# EAGLE board qo-100-upconverter (EAGLE 9.6.2), part 1 of 2
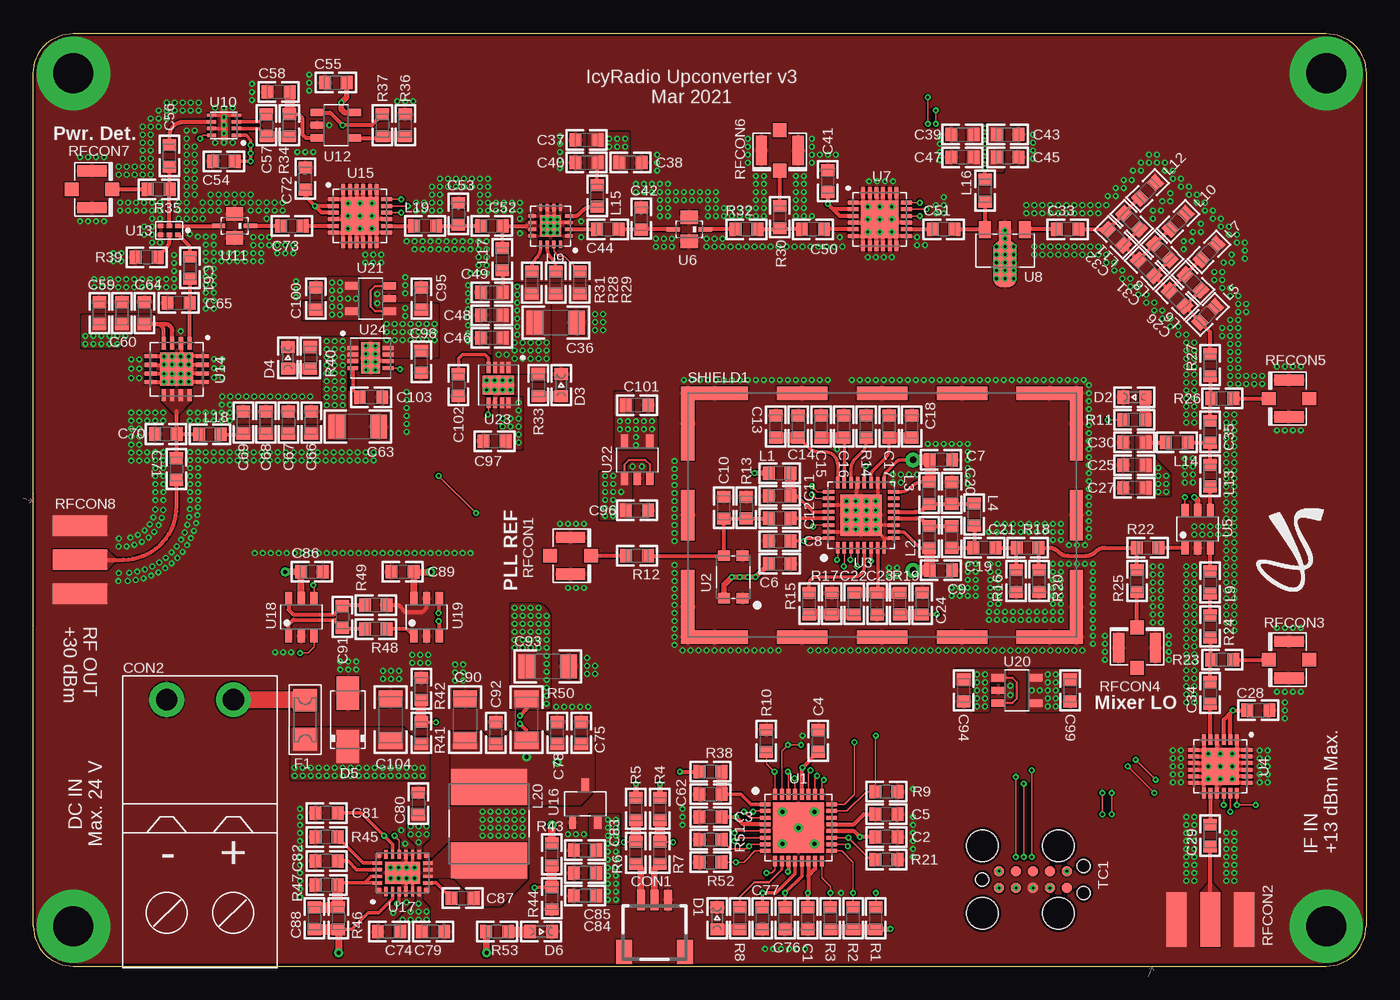
[diagram p13: board, top side]
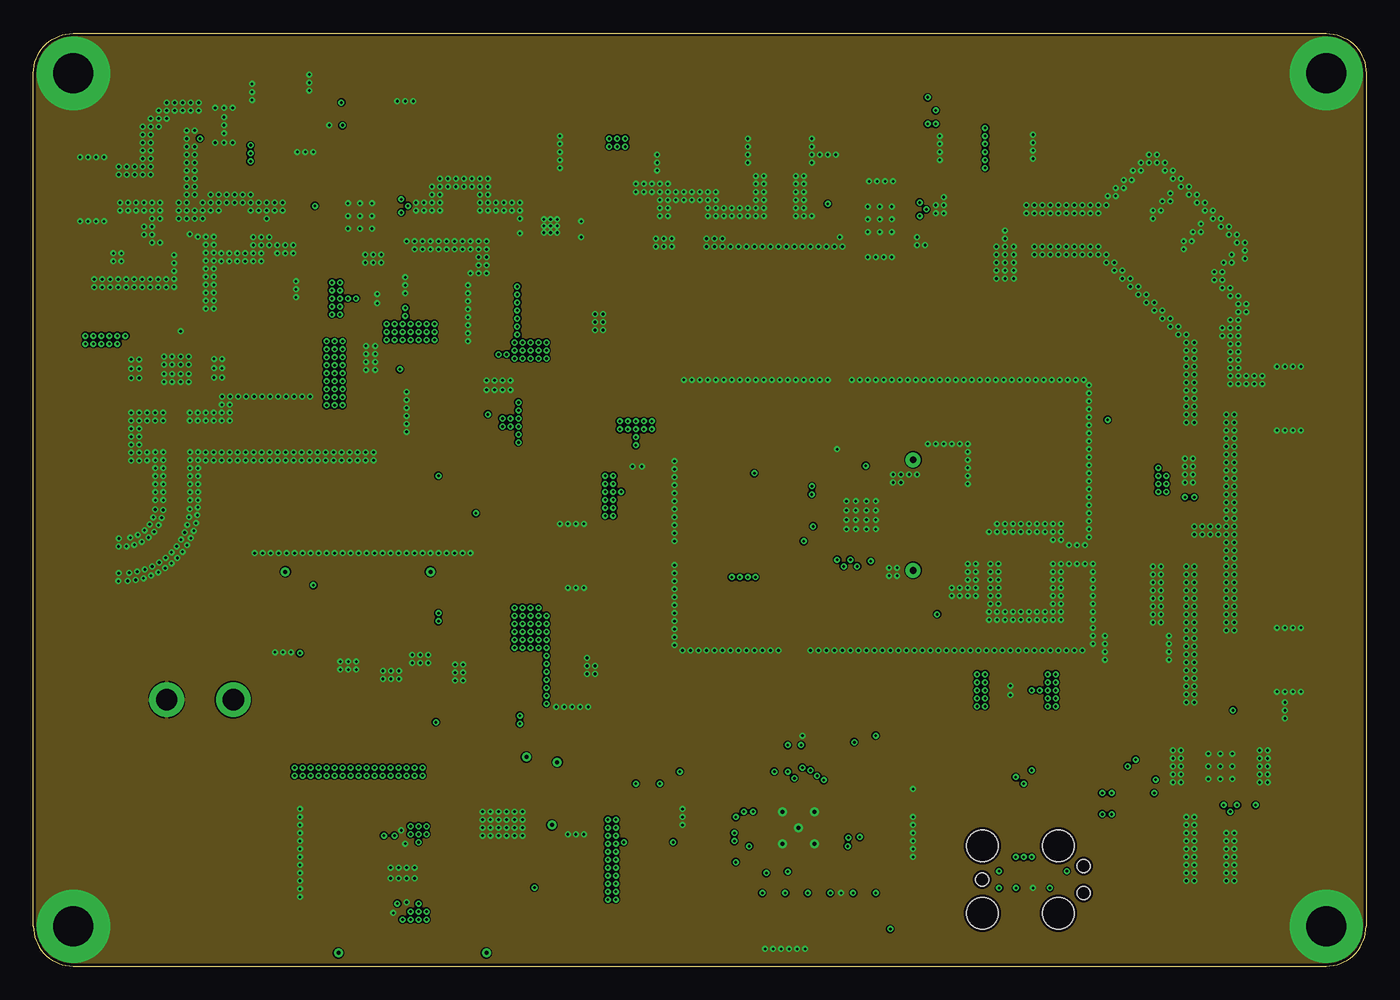
[diagram p14: board, inner layer Route2]
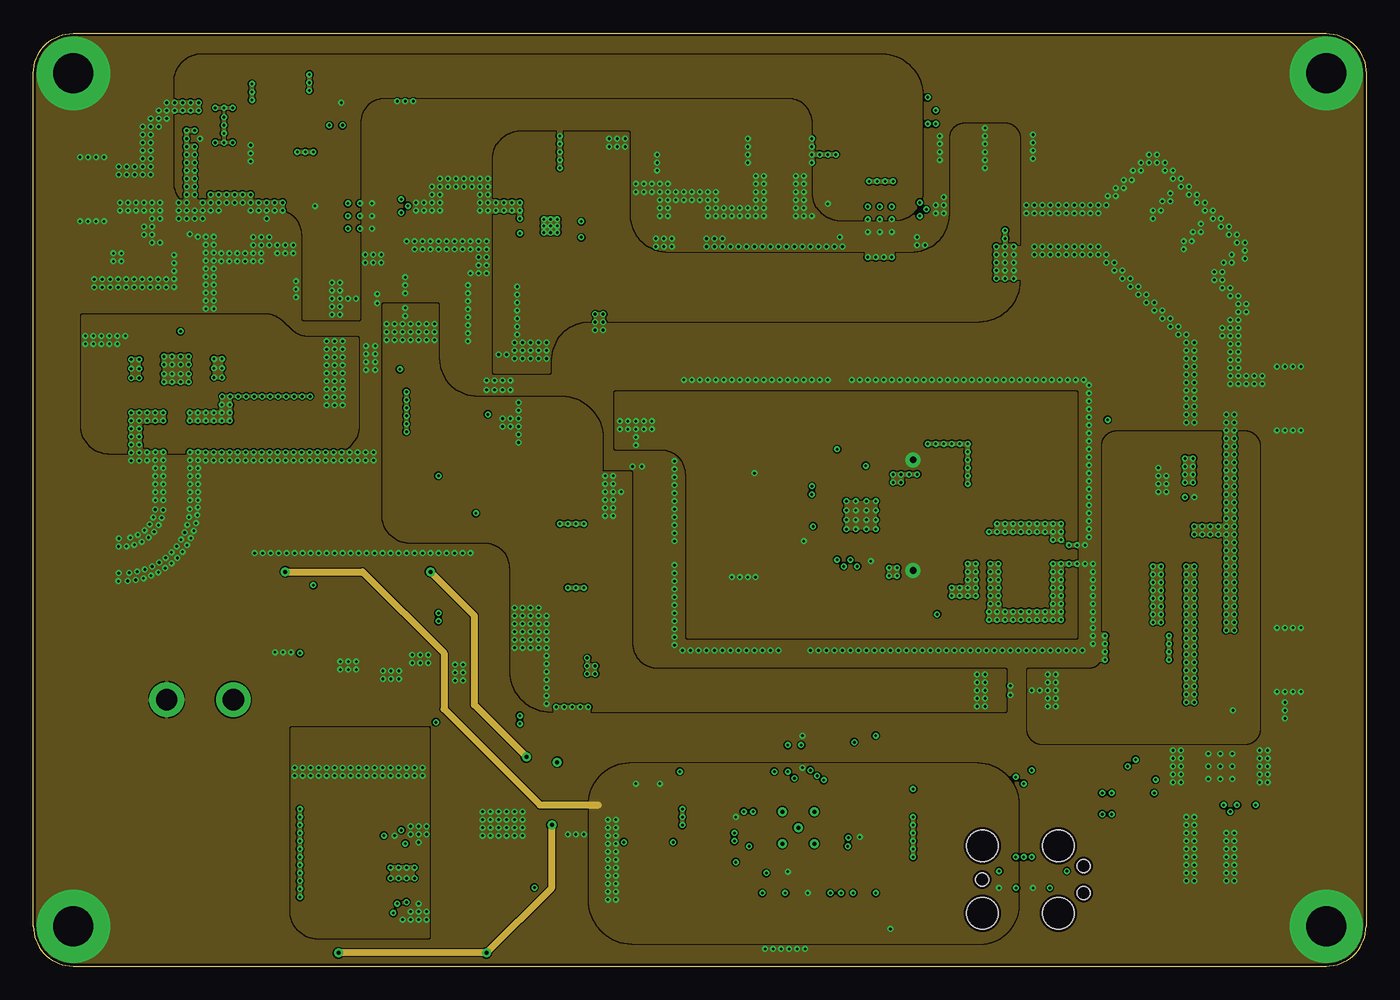
[diagram p15: board, inner layer Route15]
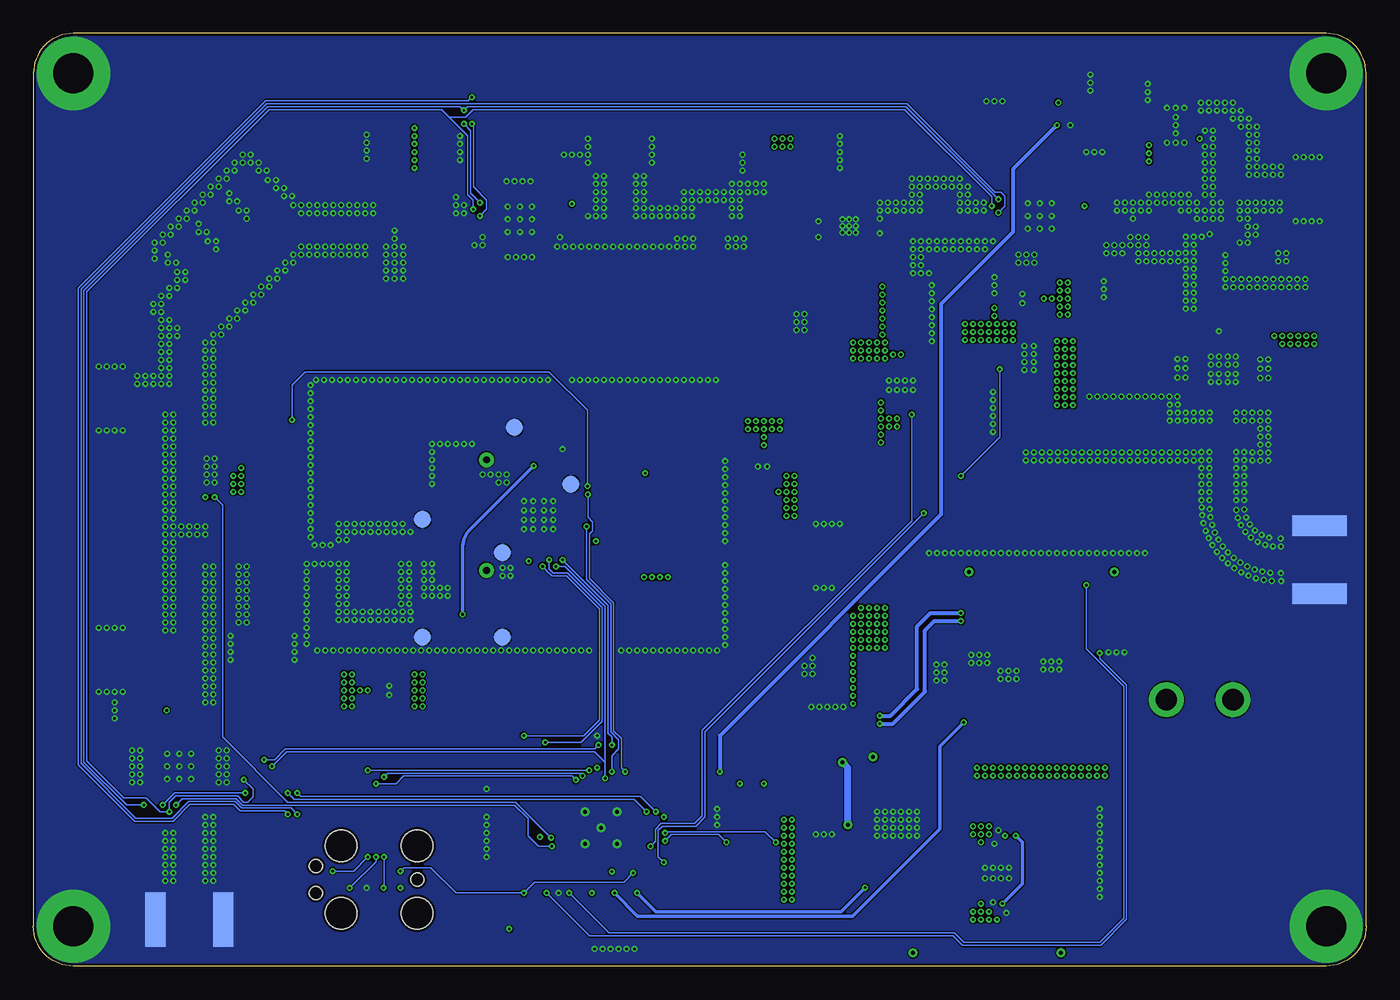
[diagram p16: board, bottom side, seen from below]

Size 100 x 70 mm. Coordinates in mm from the lower left corner, seen from the top.
Outline: 3,0 97,0 arc90 100,3 100,67 arc90 97,70 3,70 arc90 0,67 0,3 arc90 3,0
Copper layers (1+2*15+16): Top 0.035mm / dielectric 0.2mm / Route2 0.0175mm / dielectric 0.665mm / Route15 0.0175mm / dielectric 0.2mm / Bottom 0.035mm
Design rules "jlcpcb_4layer": minimum track width 3.5mil, minimum drill 0.2mm, track to track 3.5mil, track to pad 3.5mil, pad to pad 3.5mil, via to via 5mil, smd to smd 3.5mil, copper to edge 0.2mm, drill to drill 5mil, minimum pad ring 3mil, minimum via ring 3mil, stop-mask expansion 0.075mm, vias tented up to drill 10mm, thermal gap 3.5mil

## Footprints (pad centres in the part's own frame; a part is rotated, then mirrored left to right if it is on the bottom)
CAP0603 = smd 0.889 x 1.016: 1 -0.819,0; 2 0.819,0
CAP1206 = smd 1.27 x 1.778: 1 -1.549,0; 2 1.549,0
SH-03-SIDE = smd 0.6 x 1.55: 1 -1,2.975; 2 0,2.975; 3 1,2.975 | smd 1.2 x 1.8: FIT@1 -2.3,-0.9; FIT@2 2.3,-0.9
2EDG-2P-5MM = drill 1.6 pad 2.6: P$1 -2.5,0; P$2 2.5,0
0603 = smd 0.889 x 1.016: A 0.819,0; C -0.819,0
DO214AC = smd 2.5 x 1.7: A 2,0; C -2,0
1206 = smd 1.7 x 1.803: 1 -1.472,0; 2 1.472,0
IND0603 = smd 0.889 x 1.016: 1 -0.819,0; 2 0.819,0
IND0606 = smd 2.7 x 5.7: 1 -2.75,0; 2 2.75,0
RES0603 = smd 0.889 x 1.016: 1 -0.819,0; 2 0.819,0
RES1206 = smd 1.27 x 1.778: 1 -1.549,0; 2 1.549,0
U.FL = smd 2.2 x 0.85: P$1 0,1.375; P$2 0,-1.375 | smd 1.05 x 1: P$3 1.525,0; P$4 -1.525,0
SMA-EDGE = smd 1.524 x 4.064: GND@0 -2.54,0; GND@1 2.54,0; SIG 0,0 | smd 1.524 x 4.064 bottom: GND@2 -2.54,0; GND@3 2.54,0
2118728 = smd 5 x 1: 1 2.5,0.5; 5 27.66,0.5; 9 27.66,18.8; 13 2.5,18.8 | smd 3.8 x 1: 2 9.08,0.5; 3 15.08,0.5; 4 21.08,0.5; 10 21.08,18.8; 11 15.08,18.8; 12 9.08,18.8 | smd 1 x 5.55: 6 29.66,2.775; 8 29.66,16.525; 14 0.5,16.525; 16 0.5,2.775 | smd 1 x 3.8: 7 29.66,9.65; 15 0.5,9.65
TC2050-IDC = smd 0.787 x 0.787: 1 -2.54,-0.635; 2 -1.27,-0.635; 3 0,-0.635; 4 1.27,-0.635; 5 2.54,-0.635; 6 2.54,0.635; 7 1.27,0.635; 8 0,0.635; 9 -1.27,0.635; 10 -2.54,0.635 | hole 0.991: -3.81,0; 3.81,1.016; 3.81,-1.016 | hole 2.375: -3.81,2.54; -3.81,-2.54; 1.905,2.54; 1.905,-2.54
PAD1.27MM = smd 1.27 x 1.27: TP 0,0
QFN32_0.5P_TG = smd 0.8 x 0.3: 1 -2.5,1.75; 2 -2.5,1.25; 3 -2.5,0.75; 4 -2.5,0.25; 5 -2.5,-0.25; 6 -2.5,-0.75; 7 -2.5,-1.25; 8 -2.5,-1.75; 17 2.5,-1.75; 18 2.5,-1.25; 19 2.5,-0.75; 20 2.5,-0.25; 21 2.5,0.25; 22 2.5,0.75; 23 2.5,1.25; 24 2.5,1.75 | smd 0.3 x 0.8: 9 -1.75,-2.5; 10 -1.25,-2.5; 11 -0.75,-2.5; 12 -0.25,-2.5; 13 0.25,-2.5; 14 0.75,-2.5; 15 1.25,-2.5; 16 1.75,-2.5; 25 1.75,2.5; 26 1.25,2.5; 27 0.75,2.5; 28 0.25,2.5; 29 -0.25,2.5; 30 -0.75,2.5; 31 -1.25,2.5; 32 -1.75,2.5 | smd 3.8 x 3.8: 33 0,0
TCXO-3225 = smd 0.78 x 0.9: 1 -1.6,-0.7; 2 1.6,-0.7; 3 1.6,0.7; 4 -1.6,0.7
QFN32 = smd 0.86 x 0.26: 1 -2.435,1.75; 2 -2.435,1.25; 3 -2.435,0.75; 4 -2.435,0.25; 5 -2.435,-0.25; 6 -2.435,-0.75; 7 -2.435,-1.25; 8 -2.435,-1.75; 17 2.435,-1.75; 18 2.435,-1.25; 19 2.435,-0.75; 20 2.435,-0.25; 21 2.435,0.25; 22 2.435,0.75; 23 2.435,1.25; 24 2.435,1.75 | smd 0.26 x 0.86: 9 -1.75,-2.435; 10 -1.25,-2.435; 11 -0.75,-2.435; 12 -0.25,-2.435; 13 0.25,-2.435; 14 0.75,-2.435; 15 1.25,-2.435; 16 1.75,-2.435; 25 1.75,2.435; 26 1.25,2.435; 27 0.75,2.435; 28 0.25,2.435; 29 -0.25,2.435; 30 -0.75,2.435; 31 -1.25,2.435; 32 -1.75,2.435 | smd 3.1 x 3.1: 33 0,0
QFN24_2 = smd 0.8 x 0.3: 1 -2,1.25; 2 -2,0.75; 3 -2,0.25; 4 -2,-0.25; 5 -2,-0.75; 6 -2,-1.25; 13 2,-1.25; 14 2,-0.75; 15 2,-0.25; 16 2,0.25; 17 2,0.75; 18 2,1.25 | smd 0.3 x 0.8: 7 -1.25,-2; 8 -0.75,-2; 9 -0.25,-2; 10 0.25,-2; 11 0.75,-2; 12 1.25,-2; 19 1.25,2; 20 0.75,2; 21 0.25,2; 22 -0.25,2; 23 -0.75,2; 24 -1.25,2 | smd 2.8 x 2.8: 25 0,0
SOT23-6 = smd 1 x 0.55: 1 -1.4,0.95; 2 -1.4,0; 3 -1.4,-0.95; 4 1.4,-0.95; 5 1.4,0; 6 1.4,0.95
2450BP15E0100 = smd 1.3 x 1: 1 0,0.9; 3 0,-0.9 | smd 1 x 0.35: 2 1.2,0; 4 -1.2,0
SOT89 = smd 0.9 x 1.3: 1 -1.5,-1.562; 3 1.5,-1.562 | smd 0.9 x 1.5: 2 0,-1.462 | smd 1.733 x 3.5: 4 0,0.988
QFN16 = smd 0.55 x 0.25: 1 -1.375,0.75; 2 -1.375,0.25; 3 -1.375,-0.25; 4 -1.375,-0.75; 9 1.375,-0.75; 10 1.375,-0.25; 11 1.375,0.25; 12 1.375,0.75 | smd 0.25 x 0.55: 5 -0.75,-1.375; 6 -0.25,-1.375; 7 0.25,-1.375; 8 0.75,-1.375; 13 0.75,1.375; 14 0.25,1.375; 15 -0.25,1.375; 16 -0.75,1.375 | smd 1.6 x 1.6: 17 0,0
DFN8_2X2 = smd 0.7 x 0.25: 1 -0.925,0.75; 2 -0.925,0.25; 3 -0.925,-0.25; 4 -0.925,-0.75; 5 0.925,-0.75; 6 0.925,-0.25; 7 0.925,0.25; 8 0.925,0.75 | smd 0.25 x 1.6: 9 0,0
SOT23-5 = smd 1 x 0.55: 1 -1.4,0.95; 2 -1.4,0; 3 -1.4,-0.95; 4 1.4,-0.95; 5 1.4,0.95
DC2337J5010AHF = smd 0.41 x 0.33: 1 0.66,0.33; 2 0,0.33; 3 -0.66,0.33; 4 -0.66,-0.33; 5 0,-0.33; 6 0.66,-0.33
LFCSP16_4X4 = smd 0.908 x 0.306: 1 -1.94,0.975; 2 -1.94,0.325; 3 -1.94,-0.325; 4 -1.94,-0.975; 9 1.94,-0.975; 10 1.94,-0.325; 11 1.94,0.325; 12 1.94,0.975 | smd 0.306 x 0.908: 5 -0.975,-1.94; 6 -0.325,-1.94; 7 0.325,-1.94; 8 0.975,-1.94; 13 0.975,1.94; 14 0.325,1.94; 15 -0.325,1.94; 16 -0.975,1.94 | smd 2.489 x 2.489: 17 0,0
SOT23 = smd 1 x 0.55: 1 -1.4,0.95; 2 -1.4,-0.95; 3 1.394,0
QFN20_ASYM_CORNER = smd 0.7 x 0.25: 1 -1.4,1.25; 2 -1.4,0.75; 3 -1.4,0.25; 4 -1.4,-0.25; 5 -1.4,-0.75; 6 -1.4,-1.25; 11 1.4,-1.25; 12 1.4,-0.75; 13 1.4,-0.25; 14 1.4,0.25; 15 1.4,0.75; 16 1.4,1.25 | smd 0.25 x 0.7: 7 -0.75,-1.9; 8 -0.25,-1.9; 9 0.25,-1.9; 10 0.75,-1.9; 17 0.75,1.9; 18 0.25,1.9; 19 -0.25,1.9; 20 -0.75,1.9 | smd 1.65 x 2.65: 21 0,0 | smd 0.375 x 0.375: M1 -1.312,1.812; M2 1.312,1.812; M3 -1.312,-1.812; M4 1.312,-1.812
LFCSP8_3X3 = smd 0.8 x 0.3: 1 -1.315,0.75; 2 -1.315,0.25; 3 -1.315,-0.25; 4 -1.315,-0.75; 5 1.315,-0.75; 6 1.315,-0.25; 7 1.315,0.25; 8 1.315,0.75 | smd 1.4 x 2.36: 9 0,0

## Placement (x,y rotation side)
C1  100nF  [CAP0603]  58.1,3.6 270 top
C2  100nF  [CAP0603]  64,9.7 0 top
C3  100nF  [CAP0603]  50.8,11.2 180 top
C4  100nF  [CAP0603]  58.9,16.9 90 top
C5  1uF  [CAP0603]  64,11.4 0 top
C6  100nF  [CAP0603]  56,30.2 0 top
C7  100nF  [CAP0603]  68.1,38 0 top
C8  100nF  [CAP0603]  56,31.9 180 top
C9  100nF  [CAP0603]  68.1,29.7 0 top
C10  10pF  [CAP0603]  51.8,34.4 90 top
C11  100nF  [CAP0603]  56,35.3 180 top
C12  10pF  [CAP0603]  56,33.6 0 top
C13  100nF  [CAP0603]  55.7,40.5 90 top
C14  10pF  [CAP0603]  57.4,40.5 90 top
C15  100nF  [CAP0603]  59.1,40.5 90 top
C16  10pF  [CAP0603]  60.8,40.5 90 top
C17  100nF  [CAP0603]  64.2,40.5 90 top
C18  10pF  [CAP0603]  65.9,40.5 90 top
C19  0.7pF  [CAP0603]  68.9,32.2 270 top
C20  0.7pF  [CAP0603]  68.9,35.5 90 top
C21  15pF  [CAP0603]  71.35,31.4 0 top
C22  20nF  [CAP0603]  61.6,27.2 270 top
C23  1nF  [CAP0603]  63.3,27.2 270 top
C24  470pF  [CAP0603]  66.7,27.2 90 top
C25  1uF  [CAP0603]  82.6,37.6 180 top
C26  1.2pF  [CAP0603]  85.8,50.1 135 top
C27  100nF  [CAP0603]  82.6,35.9 180 top
C28  100nF  [CAP0603]  91.9,19.2 0 top
C29  100pF  [CAP0603]  88.3,9.8 90 top
C30  47pF  [CAP0603]  82.6,39.3 180 top
C31  DNP  [CAP0603]  83.5,52.4 135 top
C32  DNP  [CAP0603]  81.2,54.7 135 top
C33  12pF  [CAP0603]  77.6,55.3 180 top
C34  100pF  [CAP0603]  88.3,20.5 90 top
C35  220pF  [CAP0603]  88.3,40.1 90 top
C36  100uF  [CAP1206]  39.2,48.3 0 top
C37  1uF  [CAP0603]  41.5,62 180 top
C38  100nF  [CAP0603]  44.8,60.3 0 top
C39  1uF  [CAP0603]  69.7,62.4 180 top
C40  33pF  [CAP0603]  41.5,60.3 180 top
C41  100nF  [CAP0603]  59.6,58.9 90 top
C42  0.8pF  [CAP0603]  45.6,56.1 90 top
C43  100nF  [CAP0603]  73.1,62.4 0 top
C44  10pF  [CAP0603]  43.1,55.3 180 top
C45  47pF  [CAP0603]  73.1,60.7 0 top
C46  1uF  [CAP0603]  34.4,47.15 180 top
C47  15pF  [CAP0603]  69.7,60.7 180 top
C48  100nF  [CAP0603]  34.4,48.85 180 top
C49  33pF  [CAP0603]  34.4,50.55 180 top
C50  15pF  [CAP0603]  58.5,55.3 180 top
C51  15pF  [CAP0603]  68.3,55.3 180 top
C52  22pF  [CAP0603]  34.4,55.55 180 top
C53  0.7pF  [CAP0603]  31.9,56.45 90 top
C54  4.7uF  [CAP0603]  14.3,60.4 180 top
C55  100nF  [CAP0603]  22.7,66.3 180 top
C56  15pF  [CAP0603]  10.2,60.8 270 top
C57  10nF  [CAP0603]  17.5,63.1 90 top
C58  1uF  [CAP0603]  18.4,65.6 180 top
C59  10uF  [CAP0603]  4.95,49 90 top
C60  10nF  [CAP0603]  6.65,49 90 top
C61  15pF  [CAP0603]  11.75,52.4 270 top
C62  10nF  [CAP0603]  50.8,12.9 180 top
C63  100uF  [CAP1206]  24.35,40.5 0 top
C64  100pF  [CAP0603]  8.35,49 90 top
C65  2pF  [CAP0603]  10.9,49.77 180 top
C66  1uF  [CAP0603]  20.85,40.8 90 top
C67  10nF  [CAP0603]  19.15,40.8 90 top
C68  100pF  [CAP0603]  17.45,40.8 90 top
C69  15pF  [CAP0603]  15.75,40.8 90 top
C70  3.3pF  [CAP0603]  9.95,39.93 180 top
C71  15pF  [CAP0603]  10.75,37.3 270 top
C72  100nF  [CAP0603]  20.4,59.1 90 top
C73  15pF  [CAP0603]  19.4,55.55 180 top
C74  4.7uF  [CAP0603]  26.7,2.6 180 top
C75  100nF  [CAP0603]  41.1,17.5 90 top
C76  470pF  [CAP0603]  56.4,3.6 270 top
C77  470pF  [CAP0603]  54.7,3.6 270 top
C78  4.7uF  [CAP0603]  39.3,17.5 90 top
C79  1uF  [CAP0603]  30,2.6 0 top
C80  1uF  [CAP0603]  28.9,12.2 90 top
C81  1uF  [CAP0603]  22,11.5 180 top
C82  10nF  [CAP0603]  22,7.9 180 top
C83  100nF  [CAP0603]  41.4,8.7 180 top
C84  10uF  [CAP0603]  41.4,5.3 180 top
C85  10uF  [CAP0603]  41.4,7 180 top
C86  100nF  [CAP0603]  20.9,29.6 0 top
C87  100nF  [CAP0603]  32.2,5.1 180 top
C88  10pF  [CAP0603]  21.1,3.6 90 top
C89  1uF  [CAP0603]  27.7,29.6 180 top
C90  100uF  [CAP1206]  32.4,18.5 90 top
C91  100nF  [CAP0603]  23.2,26.2 90 top
C92  100nF  [CAP0603]  34.7,17.5 90 top
C93  22uF  [CAP1206]  38.6,22.5 0 top
C94  1uF  [CAP0603]  69.8,20.7 270 top
C95  1uF  [CAP0603]  29.1,50.1 90 top
C96  1uF  [CAP0603]  45.3,34.2 0 top
C97  1uF  [CAP0603]  34.6,39.4 180 top
C98  1uF  [CAP0603]  29.1,45.35 270 top
C99  10uF  [CAP0603]  77.8,20.7 270 top
C100  10uF  [CAP0603]  21.2,50.1 90 top
C101  10uF  [CAP0603]  45.3,42.1 0 top
C102  1nF  [CAP0603]  31.9,43.6 270 top
C103  1nF  [CAP0603]  25.35,42.7 0 top
C104  10uF  [CAP1206]  26.8,18.5 90 top
CON1  3P-SH-SIDE  [SH-03-SIDE]  46.6,2 0 top
CON2  2EDG-2P-5MM  [2EDG-2P-5MM]  12.5,20 0 top
D1  LED0603  [0603]  51.3,3.6 270 top
D2  LED0603  [0603]  82.6,42.7 0 top
D3  LED0603  [0603]  39.6,43.6 270 top
D4  LED0603  [0603]  19.1,45.65 270 top
D5  SMAJ24A  [DO214AC]  23.6,18.5 90 top
D6  LED0603  [0603]  38.1,2.6 180 top
F1  2.6A Hold  [1206]  20.4,18.5 90 top
L1  1uH  [IND0603]  56,37 180 top
L2  3.3nH  [IND0603]  67.2,32.2 90 top
L3  10nH  [IND0603]  67.2,35.5 90 top
L4  3.3nH  [IND0603]  70.6,33.9 270 top
L5  5.1nH  [IND0603]  88.1,48.9 225 top
L6  5.1nH  [IND0603]  87,51.3 135 top
L7  3.3nH  [IND0603]  88.2,53.6 225 top
L8  0 Ohms  [IND0603]  84.7,53.6 135 top
L9  18nH  [IND0603]  88.3,28.8 90 top
L10  1.8pF  [IND0603]  85.9,55.9 225 top
L11  0 Ohms  [IND0603]  82.4,55.9 135 top
L12  2.2pF  [IND0603]  83.6,58.2 225 top
L13  3.3nH  [IND0603]  88.3,36.8 90 top
L14  1.8nH  [IND0603]  85.8,39.3 180 top
L15  1.5nH  [IND0603]  42.3,57.8 90 top
L16  470nH  [IND0603]  71.4,58.2 90 top
L17  2.2nH  [IND0603]  35.2,53.05 270 top
L18  62nH  [IND0603]  13.25,39.9 0 top
L19  0 Ohms  [IND0603]  29.4,55.55 180 top
L20  4.7uH  [IND0606]  34.2,10.7 90 top
LOGO1  JS-5MM  [JS_5MM]  97,34.55 0 top
R1  10K Ohms  [RES0603]  63.2,3.6 270 top
R2  1K Ohms  [RES0603]  61.5,3.6 270 top
R3  1K Ohms  [RES0603]  59.8,3.6 270 top
R4  1K Ohms  [RES0603]  47,11.8 90 top
R5  1K Ohms  [RES0603]  45.2,11.8 90 top
R6  100 Ohms  [RES0603]  45.2,8.5 90 top
R7  100 Ohms  [RES0603]  47,8.5 90 top
R8  330 Ohms  [RES0603]  53,3.6 90 top
R9  100K Ohms  [RES0603]  64,13.1 180 top
R10  100K Ohms  [RES0603]  55,16.9 270 top
R11  330 Ohms  [RES0603]  82.6,41 180 top
R12  0 Ohms  [RES0603]  45.3,30.8 180 top
R13  10K Ohms  [RES0603]  53.5,34.4 270 top
R14  5.1K Ohms  [RES0603]  62.5,40.5 270 top
R15  DNP  [RES0603]  58.2,27.2 90 top
R16  105 Ohms  [RES0603]  73.75,28.9 90 top
R17  330 Ohms  [RES0603]  59.9,27.2 270 top
R18  61.9 Ohms  [RES0603]  74.6,31.4 180 top
R19  1K Ohms  [RES0603]  65,27.2 90 top
R20  105 Ohms  [RES0603]  75.45,28.9 90 top
R21  10K Ohms  [RES0603]  64,8 180 top
R22  0 Ohms  [RES0603]  83.6,31.4 0 top
R23  DNP  [RES0603]  89.2,23 0 top
R24  0 Ohms  [RES0603]  88.3,25.5 270 top
R25  DNP  [RES0603]  82.8,28.9 90 top
R26  DNP  [RES0603]  89.2,42.6 0 top
R27  0 Ohms  [RES0603]  88.3,45.1 270 top
R28  1K Ohms  [RES0603]  39.2,51.3 270 top
R29  0 Ohms  [RES0603]  41,51.3 270 top
R30  DNP  [RES0603]  56,56.2 90 top
R31  1.5K Ohms  [RES0603]  37.4,51.3 270 top
R32  0 Ohms  [RES0603]  53.5,55.3 0 top
R33  510 Ohms  [RES0603]  37.9,43.6 90 top
R34  0 Ohms  [RES0603]  19.2,63.1 270 top
R35  DNP  [RES0603]  9.4,58.3 180 top
R36  1K Ohms  [RES0603]  27.9,63.1 270 top
R37  2K Ohms  [RES0603]  26.2,63.1 270 top
R38  100 Ohms  [RES0603]  50.8,14.6 180 top
R39  49.9 Ohms  [RES0603]  8.5,53.2 0 top
R40  510 Ohms  [RES0603]  20.8,45.65 90 top
R41  100K Ohms  [RES0603]  29.1,17.5 270 top
R42  10K Ohms  [RES0603]  29.1,20.8 270 top
R43  100K Ohms  [RES0603]  38.9,8.4 90 top
R44  75K Ohms  [RES0603]  38.9,5.1 90 top
R45  41.2K Ohms  [RES0603]  22,9.7 0 top
R46  1M Ohms  [RES0603]  22.9,3.6 270 top
R47  221K Ohms  [RES0603]  22,6.1 0 top
R48  10K Ohms  [RES0603]  25.7,25.3 0 top
R49  10K Ohms  [RES0603]  25.7,27.1 0 top
R50  0.03 Ohms  [RES1206]  37,18.5 270 top
R51  100K Ohms  [RES0603]  50.8,9.5 0 top
R52  100K Ohms  [RES0603]  50.8,7.8 0 top
R53  1K Ohms  [RES0603]  34.8,2.6 180 top
RFCON1  RFCON-U.FL  [U.FL]  40.3,30.8 0 top
RFCON2  RFCON-SMA-EDGE  [SMA-EDGE]  88.3,3.5 0 top
RFCON3  RFCON-U.FL  [U.FL]  94.2,23 180 top
RFCON4  RFCON-U.FL  [U.FL]  82.8,23.9 90 top
RFCON5  RFCON-U.FL  [U.FL]  94.2,42.6 180 top
RFCON6  RFCON-U.FL  [U.FL]  56,61.2 270 top
RFCON7  RFCON-U.FL  [U.FL]  4.4,58.3 0 top
RFCON8  RFCON-SMA-EDGE  [SMA-EDGE]  3.5,30.5 270 top
SHIELD1  SHIELD-TE-2118728  [2118728]  48.6,24.2 0 top
TC1  TC2050-IDC  [TC2050-IDC]  75,6.5 0 top
TP1  TESTPOINT-1.27MM  [PAD1.27MM]  63.9,40.42 0 bottom
TP2  TESTPOINT-1.27MM  [PAD1.27MM]  59.67,36.17 0 bottom
TP3  TESTPOINT-1.27MM  [PAD1.27MM]  70.8,33.52 0 bottom
TP4  TESTPOINT-1.27MM  [PAD1.27MM]  64.8,31.04 0 bottom
TP5  TESTPOINT-1.27MM  [PAD1.27MM]  64.8,24.7 0 bottom
TP6  TESTPOINT-1.27MM  [PAD1.27MM]  70.8,24.7 0 bottom
U1  EFM32TG11B120F128GM32  [QFN32_0.5P_TG]  57.4,10.4 0 top
U2  DSB321SDA  [TCXO-3225]  52.5,29.2 90 top
U3  ADF4351  [QFN32]  62.1,33.85 90 top
U4  F1958NBGK  [QFN24_2]  89.05,15 270 top
U5  MAX2671  [SOT23-6]  87.35,32.8 90 top
U6  2450BP15E0100  [2450BP15E0100]  49.2,55.3 180 top
U7  F1958NBGK  [QFN24_2]  63.5,56.05 0 top
U8  ADL5601  [SOT89]  72.9,53.7 180 top
U9  F1490NLGA  [QFN16]  38.8,55.55 180 top
U10  LTC5597  [DFN8_2X2]  14.3,63.1 180 top
U11  2450BP15E0100  [2450BP15E0100]  15.1,55.55 180 top
U12  MCP6V31  [SOT23-5]  22.7,63.1 0 top
U13  DC2337J5010AHF  [DC2337J5010AHF]  10.2,55.22 0 top
U14  ADL5606  [LFCSP16_4X4]  10.75,44.8 270 top
U15  F1958NBGK  [QFN24_2]  24.5,56.3 0 top
U16  MCP1700-330  [SOT23]  41.4,12.2 90 top
U17  LT8636  [QFN20_ASYM_CORNER]  27.7,7 90 top
U18  MCP3421-A0  [SOT23-6]  20.1,26.2 90 top
U19  MCP6C02-020  [SOT23-6]  29.5,26.2 90 top
U20  ADP7142AUJZ-3.3  [SOT23-5]  73.8,20.7 0 top
U21  ADP7142AUJZ-3.3  [SOT23-5]  25.3,50.1 180 top
U22  ADP7142AUJZ-3.3  [SOT23-5]  45.3,38 90 top
U23  ADM7171ACPZ-5.0  [LFCSP8_3X3]  34.9,43.6 270 top
U24  ADM7171ACPZ-5.0  [LFCSP8_3X3]  25.3,45.65 0 top